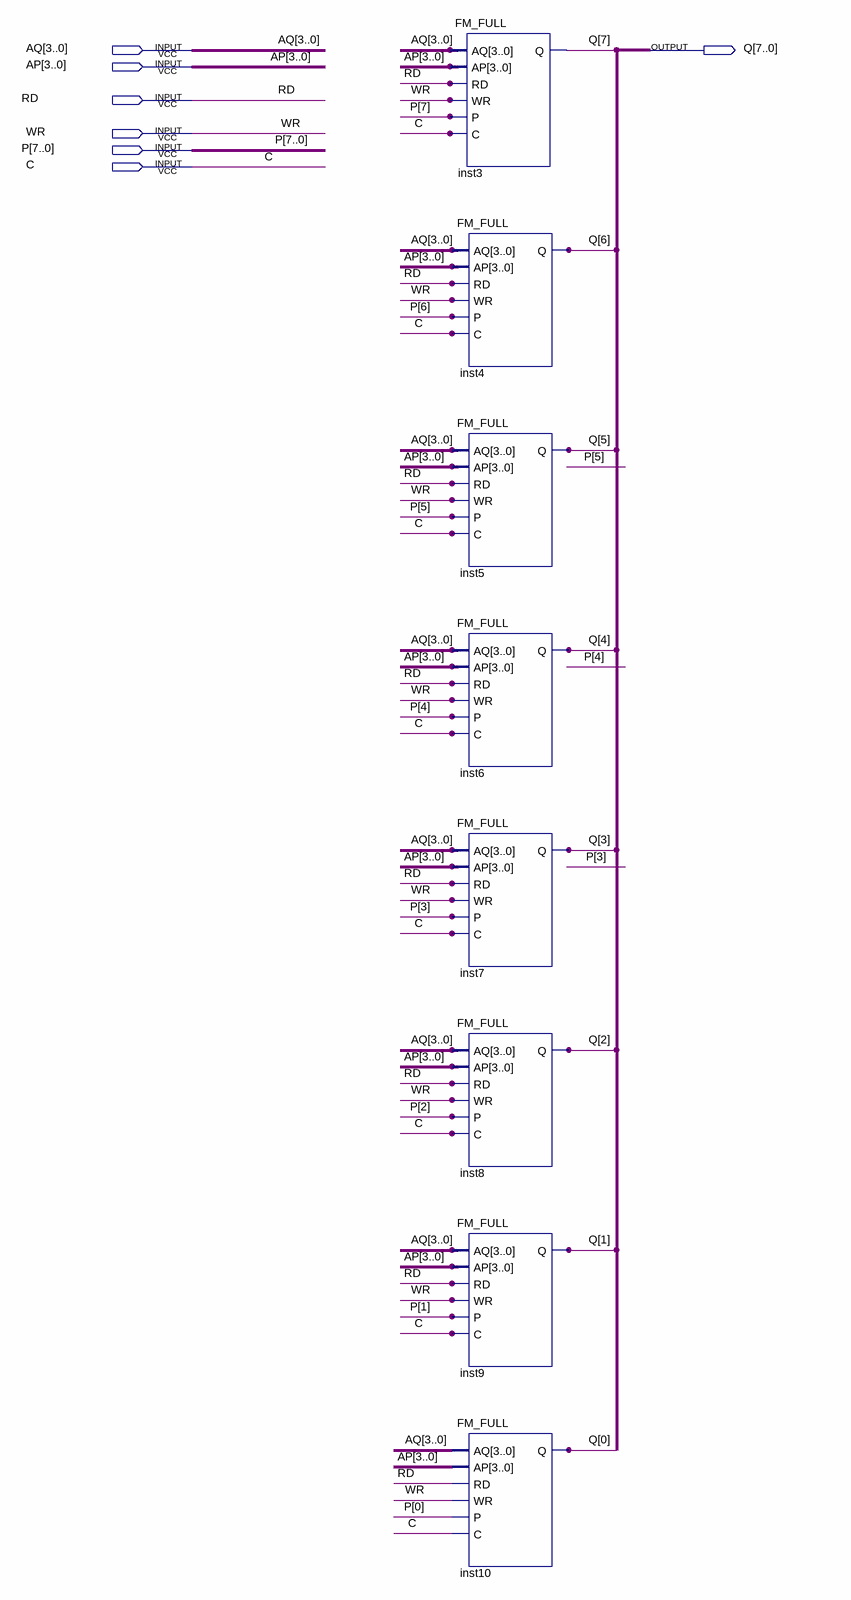
[diagram p0: schematic sheet]
// Quartus schematic fm.bdf as structural Verilog: 8 symbols, 7 pins
module fm (
  input  [3:0] AQ,
  input  [3:0] AP,
  input  RD,
  input  WR,
  input  [7:0] P,
  input  C,
  output [7:0] Q
);

  FM_FULL inst3 (.AQ(AQ), .AP(AP), .RD(RD), .WR(WR), .P(P[7]), .C(C), .Q(Q[7]));
  FM_FULL inst4 (.AQ(AQ), .AP(AP), .RD(RD), .WR(WR), .P(P[6]), .C(C), .Q(Q[6]));
  FM_FULL inst5 (.AQ(AQ), .AP(AP), .RD(RD), .WR(WR), .P(P[5]), .C(C), .Q(Q[5]));
  FM_FULL inst6 (.AQ(AQ), .AP(AP), .RD(RD), .WR(WR), .P(P[4]), .C(C), .Q(Q[4]));
  FM_FULL inst7 (.AQ(AQ), .AP(AP), .RD(RD), .WR(WR), .P(P[3]), .C(C), .Q(Q[3]));
  FM_FULL inst8 (.AQ(AQ), .AP(AP), .RD(RD), .WR(WR), .P(P[2]), .C(C), .Q(Q[2]));
  FM_FULL inst9 (.AQ(AQ), .AP(AP), .RD(RD), .WR(WR), .P(P[1]), .C(C), .Q(Q[1]));
  FM_FULL inst10 (.AQ(AQ), .AP(AP), .RD(RD), .WR(WR), .P(P[0]), .C(C), .Q(Q[0]));
endmodule
